# EAGLE schematic Schematic_grupo6 (EAGLE 9.6.2)
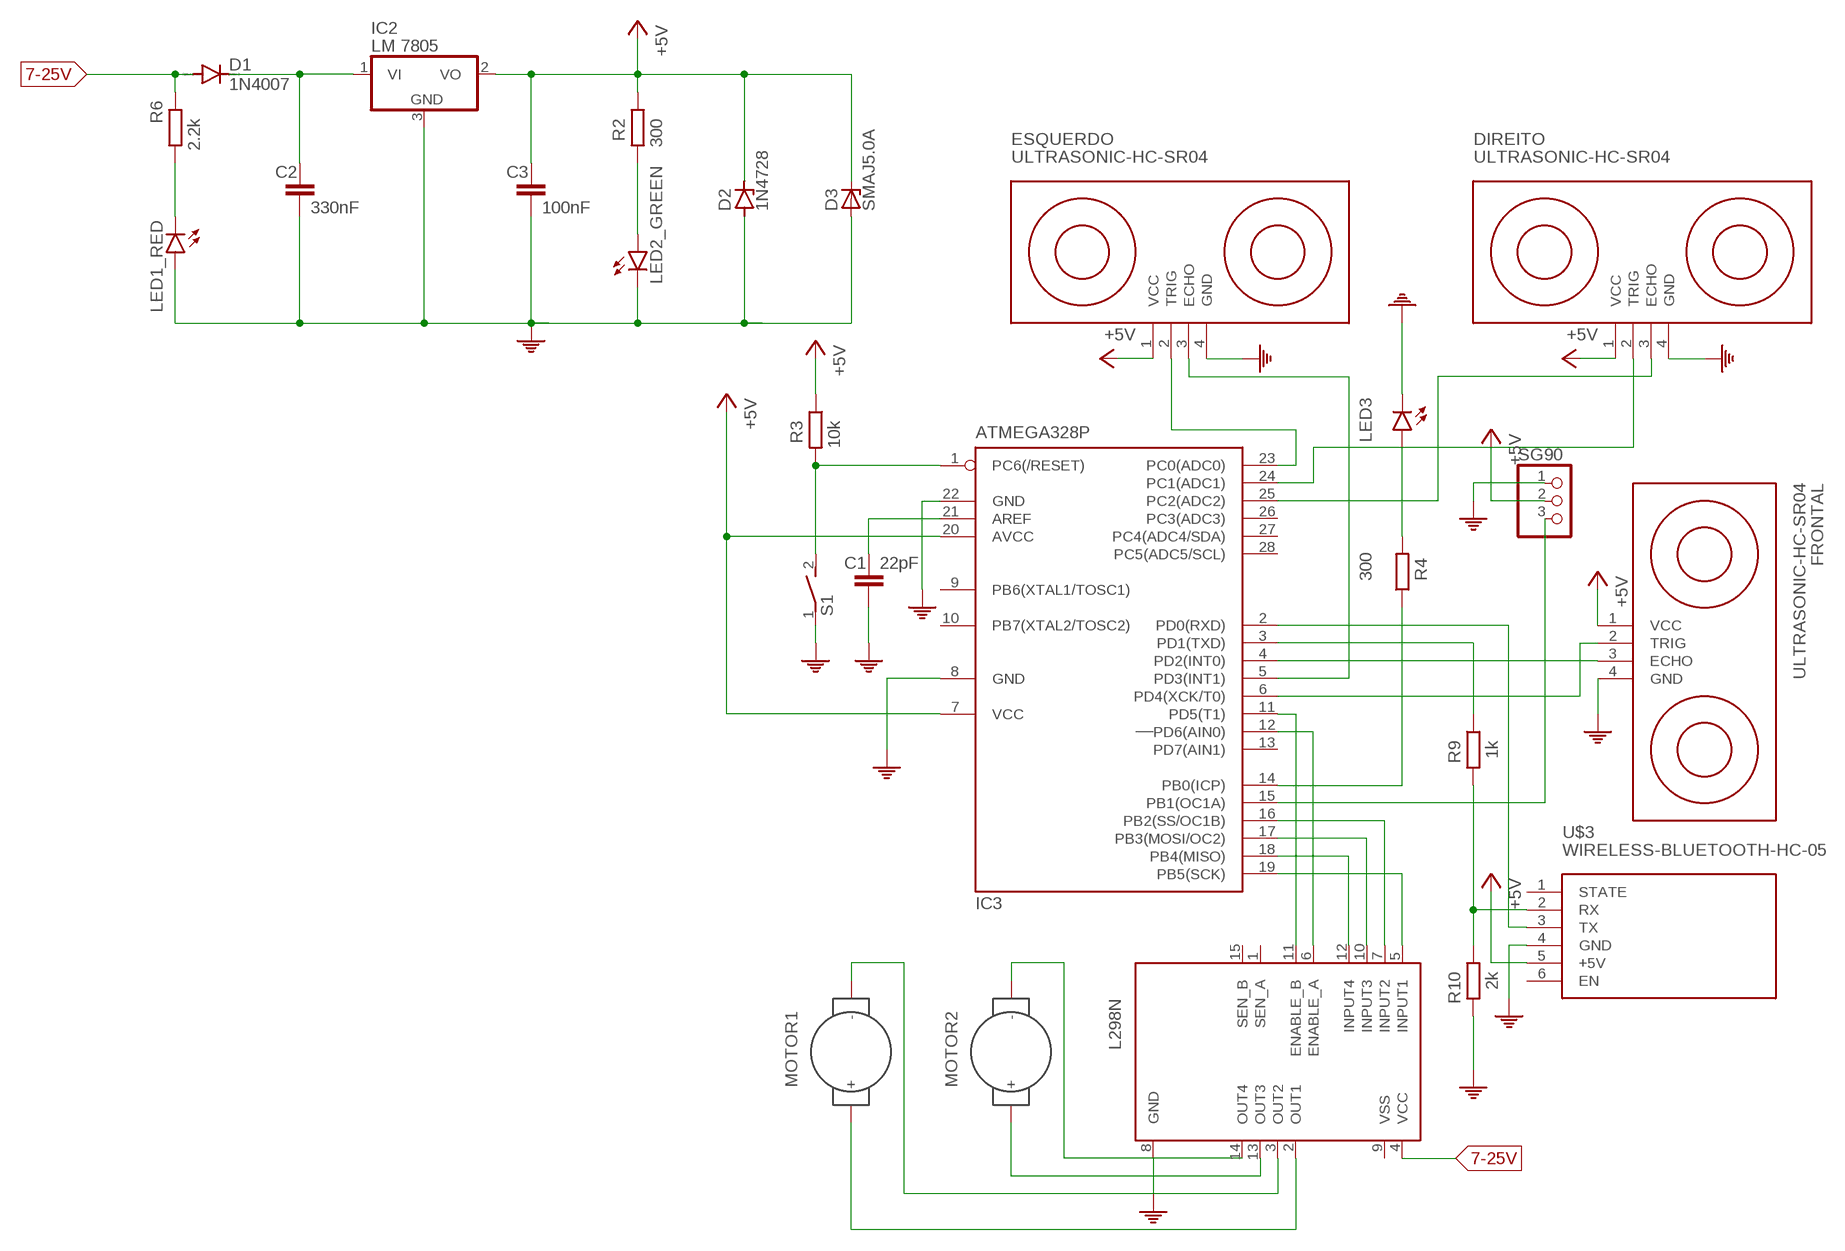
[diagram p0: schematic, sheet 1]

## Parts
C1  22pF  C2,5-3  [C2.5-3]
C2  330nF  C2,5-3  [C2.5-3]
C3  100nF  C2,5-3  [C2.5-3]
D1  1N4007  1N4004  [DO41-10]
D2  1N4728  [DO41Z10]
D3  SMAJ5.0A  [DO214AC]
DIREITO  ULTRASONIC-HC-SR04  [ULTRASONIC-HC-SR04]
ESQUERDO  ULTRASONIC-HC-SR04  [ULTRASONIC-HC-SR04]
FRONTAL  ULTRASONIC-HC-SR04  [ULTRASONIC-HC-SR04]
IC2  LM 7805  7805DT  [TO252]
IC3  ATMEGA328P  MEGA8-P  [DIL28-3]
L298N  L298MW-15-1  [MW-15]
LED1_RED  LAP4-BOTTOM  [P47F-BOTTOM]
LED2_GREEN  LAP4-BOTTOM  [P47F-BOTTOM]
LED3  LAP4-BOTTOM  [P47F-BOTTOM]
MOTOR1  MOTOR-DC  [MOTOR-DC]
MOTOR2  MOTOR-DC  [MOTOR-DC]
R2  300  R-EU_0204/5  [0204/5]
R3  10k  R-EU_0204/5  [0204/5]
R4  300  R-EU_0204/5  [0204/5]
R6  2.2k  R-EU_0204/5  [0204/5]
R9  1k  R-EU_0204/5  [0204/5]
R10  2k  R-EU_0204/5  [0204/5]
S1  DS01E  [DS-01]
SG90  PINHD-1X3  [1X03]
U$3  WIRELESS-BLUETOOTH-HC-05  [WIRELESS-BLUETOOTH-HC-05]

## Nets
0: LED3.C S1.1
7-25V: D1.A L298N.4(VCC) R6.1
+5V: DIREITO.1(VCC) ESQUERDO.1(VCC) FRONTAL.1(VCC) SG90.2 U$3.5(+5V)
.: C3.1 D2.C D3.C IC2.2(VO) R2.1 R3.1 ; supply symbol labelled +5V
AVCC: IC3.7(VCC) IC3.20(AVCC) ; supply symbol labelled +5V
N$1: LED3.A R4.2
N$2: IC3.12(PD6(AIN0)) L298N.6(ENABLE_A)
N$3: LED1_RED.C R6.2
N$4: C2.1 D1.C IC2.1(VI)
N$5: LED2_GREEN.A R2.2
N$6: IC3.11(PD5(T1)) L298N.11(ENABLE_B)
N$7: FRONTAL.3(ECHO) IC3.4(PD2(INT0))
N$8: FRONTAL.2(TRIG) IC3.6(PD4(XCK/T0))
N$9: IC3.3(PD1(TXD)) R9.1
N$10: IC3.2(PD0(RXD)) U$3.3(TX)
N$11: IC3.19(PB5(SCK)) L298N.5(INPUT1)
N$12: R9.2 R10.1 U$3.2(RX)
N$13: C1.1 IC3.21(AREF)
N$14: IC3.1(PC6(/RESET)) R3.2 S1.2
N$15: IC3.14(PB0(ICP)) R4.1
N$16: ESQUERDO.3(ECHO) IC3.5(PD3(INT1))
N$17: DIREITO.3(ECHO) IC3.25(PC2(ADC2))
N$18: L298N.14(OUT4) MOTOR2.2(-)
N$19: L298N.13(OUT3) MOTOR2.1(+)
N$20: ESQUERDO.2(TRIG) IC3.23(PC0(ADC0))
N$21: DIREITO.2(TRIG) IC3.24(PC1(ADC1))
N$22: L298N.3(OUT2) MOTOR1.2(-)
N$23: L298N.2(OUT1) MOTOR1.1(+)
PB1: IC3.15(PB1(OC1A)) SG90.3
PB2: IC3.16(PB2(SS/OC1B)) L298N.7(INPUT2)
PB3: IC3.17(PB3(MOSI/OC2)) L298N.10(INPUT3)
PB4: IC3.18(PB4(MISO)) L298N.12(INPUT4)
PE: C1.2 C2.2 C3.2 D2.A D3.A DIREITO.4(GND) ESQUERDO.4(GND) FRONTAL.4(GND) IC2.3(GND) IC3.8(GND) IC3.22(GND) L298N.8(GND) LED1_RED.A LED2_GREEN.C R10.2 SG90.1 U$3.4(GND)
Unconnected: IC3.9(PB6(XTAL1/TOSC1)) IC3.10(PB7(XTAL2/TOSC2)) IC3.13(PD7(AIN1)) IC3.26(PC3(ADC3)) IC3.27(PC4(ADC4/SDA)) IC3.28(PC5(ADC5/SCL)) L298N.1(SEN_A) L298N.15(SEN_B) U$3.1(STATE) U$3.6(EN)

## Power pins joined to a net without a drawn wire
VSS: L298N.9(VSS)

## Library data of the parts
C1 = capacitor-wima:C: CAPACITOR naming: grid - package width; MF: VISHAY; MPN: K220J15C0GF5TL2; OC_NEWARK: 95C1007
C2 = capacitor-wima:C: CAPACITOR naming: grid - package width; MF: VISHAY; MPN: BFC237012334; OC_NEWARK: 95C1392
C3 = capacitor-wima:C: CAPACITOR naming: grid - package width; MF: VISHAY; MPN: S104Z93Z5VL83L0R; OC_NEWARK: 32X6514
D1 = diode:1N4004: DIODE general purpose rectifier, 1 A; MF: VISHAY; MPN: 1N4007GP-E3/54; OC_NEWARK: 05R5988
D2 = diode:1N4728: Z DIODE 3.3 V, 1W, 5 percent; MF: VISHAY; MPN: 1N4728A-TR; OC_NEWARK: 18M3501
D3 = smaj_10:SMAJ*A: SMAJ Series TVS Diodes Source: http://www.littelfuse.com/~/media/electronics/datasheets/tvs_diodes/littelfuse_tvs_diode_smaj_datasheet.pdf.pdf; MF: LITTELFUSE; MPN: SMAJ5.0A; OC_FARNELL: 1827607; OC_NEWARK: 71J2029
DIREITO ESQUERDO FRONTAL = diy-modules:ULTRASONIC-HC-SR04: Ultrasonic Ranging Module HC-SR04 More details available here: http://randomnerdtutorials.com/complete-guide-for-ultrasonic-sensor-hc-sr04/ Click here to find device on ebay.com <http://www.ebay.com/sch/hc+sr04+ultrasonic>; OC_NEWARK: unknown
IC2 = linear:78*: Positive VOLTAGE REGULATOR Source: http://cache.national.com/ds/LM/LM78L05.pdf http://www.fairchildsemi.com/ds/LM/LM7805.pdf; MF: ON SEMICONDUCTOR; MPN: MC7805ABTG; OC_NEWARK: 37X6487
IC3 = atmel:MEGA8-P: MICROCONTROLLER 8 Kbytes FLASH, 1 kbytes SRAM, 512 bytes EEPROM, USART, 4-channel 10 bit ADC, 2-channel 8 bit ADC Pin compatible with Atmega48, ATMega88, ATMega168 Source: avr.lbr; OC_FARNELL: unknown; OC_NEWARK: unknown
L298N = stepper_drivers_etc:L298: ST-Microelectronics Stepper Motor Driver; OC_NEWARK: unknown
LED1_RED LED2_GREEN LED3 = led:*P4: PointLED® Enhanced Thinfilm LED TOP & BOTTOM mount LS P47F, LR P47F, LA P47F, LY P47F, LT P4SG, LB P4SG, LW P4SG Source: http://catalog.osram-os.com .. LA_LR_LS_LY_P47F_Pb_free.pdf; OC_NEWARK: unknown
MOTOR1 MOTOR2 = untitled:MOTOR-DC
R2 R4 = rcl:R-EU_: RESISTOR, European symbol; OC_NEWARK: unknown; SPICEPREFIX: R
R3 = rcl:R-EU_: RESISTOR, European symbol; MF: MULTICOMP PRO; MPN: MCMF0W2FF1002A10; OC_NEWARK: 58K3725; SPICEPREFIX: R
R6 = rcl:R-EU_: RESISTOR, European symbol; MF: MULTICOMP PRO; MPN: MOR03SJ0222A19; OC_NEWARK: 74M3351; SPICEPREFIX: R
R9 = rcl:R-EU_: RESISTOR, European symbol; MF: MULTICOMP PRO; MPN: MCMF03WJJ0102AA9; OC_NEWARK: 97M4547; SPICEPREFIX: R
R10 = rcl:R-EU_: RESISTOR, European symbol; MF: MULTICOMP PRO; MPN: MCF 0.25W 2K2; OC_NEWARK: 38K0352; SPICEPREFIX: R
S1 = switch-dil:DS01E: DIL/CODE SWITCH; OC_FARNELL: unknown; OC_NEWARK: unknown
SG90 = pinhead:PINHD-1X3: PIN HEADER; OC_NEWARK: unknown; SPICEPREFIX: J
U$3 = diy-modules:WIRELESS-BLUETOOTH-HC-05: Bluetooth Transceiver Module based on HC-05 board Tutorial is available here: https://arduino-info.wikispaces.com/BlueTooth-HC05-HC06-Modules-How-To Click here to find device on ebay.com <http://www.ebay.com/sch/hc-05+module+rs232>; OC_NEWARK: unknown